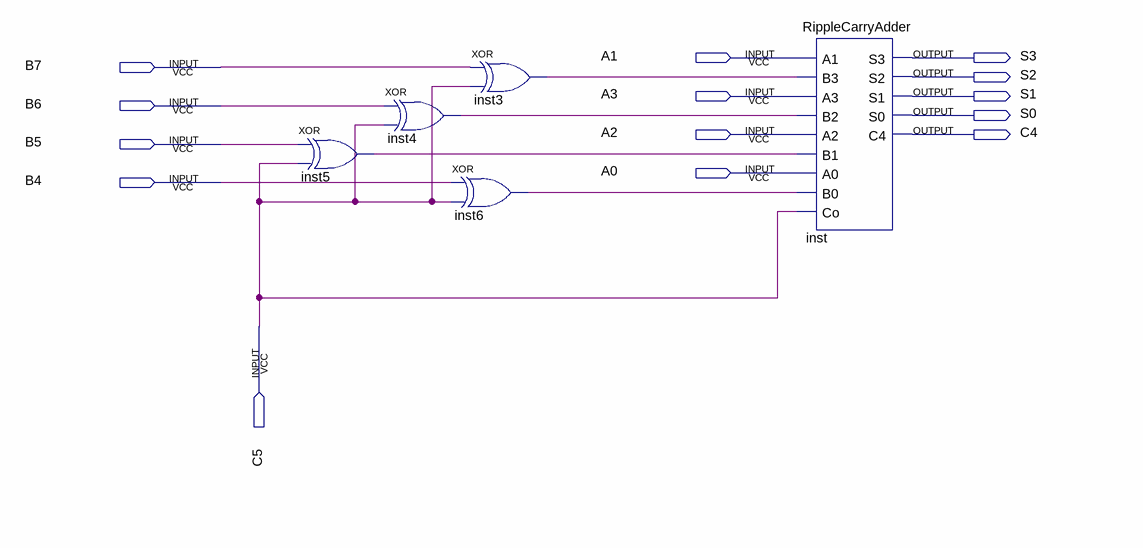
[diagram p0: schematic sheet]
// Quartus schematic Lab4Schematic.bdf as structural Verilog: 5 symbols, 14 pins
module Lab4Schematic (
  input  A1,
  input  B7,
  input  A3,
  input  B6,
  input  A2,
  input  B5,
  input  A0,
  input  B4,
  input  C5,
  output S3,
  output S2,
  output S1,
  output S0,
  output C4
);

  wire inst3_out, inst4_out, inst5_out, inst6_out;

  xor inst5 (inst5_out, B5, C5);
  xor inst4 (inst4_out, B6, C5);
  xor inst3 (inst3_out, B7, C5);
  xor inst6 (inst6_out, B4, C5);
  RippleCarryAdder inst (
    .A1(A1), .B3(inst3_out), .A3(A3), .B2(inst4_out), .A2(A2), .B1(inst5_out), .A0(A0), .B0(inst6_out),
    .Co(C5), .S3(S3), .S2(S2), .S1(S1), .S0(S0), .C4(C4));
endmodule
